# Altium schematic sheet Charging.SchDoc
size A; SheetNumber: 6
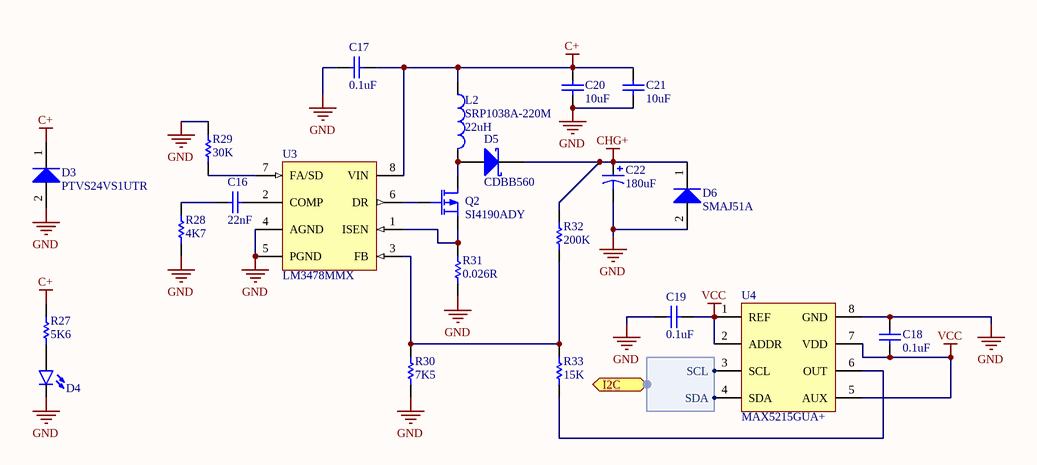
[diagram p0: Charging.SchDoc]

## Parts
C16  value 22nF  [C0402[1005X55]]  (hidden comment: 22nF 50V 0402)
C17  value 0.1uF  [C0402[1005X55]]  (hidden comment: 0.1uF 100V 0402)
C18  value 0.1uF  [C0402[1005X55]]  (hidden comment: 0.1uF 6.3V 0402)
C19  value 0.1uF  [C0402[1005X55]]  (hidden comment: 0.1uF 6.3V 0402)
C20  value 10uF  [C1206[3216X160]]  (hidden comment: 10uF 50V 1206)
C21  value 10uF  [C1206[3216X160]]  (hidden comment: 10uF 50V 1206)
C22  value 180uF  [CAP-ELECTROLYTIC[10.0x12.6]]  (hidden comment: 180uF 50V)
D3  PTVS24VS1UTR  [SOD-123W]
D4  LED_0603_GREEN_5mA  [LED0603]  (value not drawn)
D5  CDBB560  [DO-214AA]
D6  SMAJ51A  [DO-214AC]
L2  SRP1038A-220M  value 22uH  [SRP1038A]
Q2  SI4190ADY  [SO-8]
R27  value 5K6  [R0402[1005]]  (hidden comment: 5K6 1% 0402)
R28  value 4K7  [R0402[1005]]  (hidden comment: 4K7 1% 0402)
R29  value 30K  [R0402[1005]]  (hidden comment: 30K 1% 0402)
R30  value 7K5  [R0402[1005]]  (hidden comment: 7K5 1% 0402)
R31  value 0.026R  [R1206[3216]]  (hidden comment: 0.026R 1% 1206)
R32  value 200K  [R0402[1005]]  (hidden comment: 200K 1% 0402)
R33  value 15K  [R0402[1005]]  (hidden comment: 15K 1% 0402)
U3  LM3478MMX  [MSOP-8]
U4  MAX5215GUA+  [MSOP-8]

## Ports
I2C (harness I2C)

## Harnesses
I2C: SCL, SDA

## Nets
C+: C17.2 C20.2 C21.2 D3.1(K) L2.1 R27.2 U3.8(VIN)
CHG+: C22.1 D5.2(K) D6.1(K) R32.2
GND: C17.1 C18.1 C19.1 C20.1 C21.1 C22.2 D3.2(A) D4.C D6.2(A) R28.1 R29.2 R30.1 R31.1 U3.4(AGND) U3.5(PGND) U4.8(GND)
VCC: C18.2 C19.2 U4.1(REF) U4.2(ADDR) U4.5(AUX) U4.7(VDD)
NetC16_1: C16.1 R28.2
NetC16_2: C16.2 U3.2(COMP)
NetD4_A: D4.A R27.1
NetD5_1: D5.1(A) L2.2 Q2.3(D)
NetQ2_1: Q2.1(S) R31.2 U3.1(ISEN)
NetQ2_2: Q2.2(G) U3.6(DR)
NetR29_1: R29.1 U3.7(FA/SD)
NetR30_2: R30.2 R32.1 R33.2 U3.3(FB)
NetR33_1: R33.1 U4.6(OUT)
NetU4_3: U4.3(SCL) ; port I2C.SCL
NetU4_4: U4.4(SDA) ; port I2C.SDA

## Library data of the parts
C16 = CAP_22nF_50V_0402_10%: 22nF 50V 10% 0402 (1005 Metric); PartNumber: GRM155R71H223KA12J; Manufacturer: Murata; Tolerance: 10%; Mounting Technology: Surface Mount; PackageReference: 0402; PackageDescription: 0402 (1005 Metric); Voltage: 50V
C17 = CAP_0.1uF_100V_0402_10%: 0.1uF 100V 10% 0402 (1005 Metric); PartNumber: GRM155R62A104KE14D; Manufacturer: Murata; Mounting Technology: Surface Mount; PackageReference: 0402; PackageDescription: 0402 (1005 Metric); Voltage: 100V; Tolerance: 10%
C18 C19 = CAP_0.1uF_6.3V_0402_10%: 0.1uF 6.3V 10% 0402 (1005 Metric); PartNumber: GRM155R70J104KA01D; Manufacturer: Murata; Mounting Technology: Surface Mount; PackageReference: 0402; PackageDescription: 0402 (1005 Metric); Voltage: 6.3V; Tolerance: 10%
C20 C21 = CAP_10uF_50V_1206_20%: 10uF 50V 20% 1206 (3216 Metric); PartNumber: UMK316BBJ106ML-T; Manufacturer: Taiyo Yuden; Tolerance: 20%; Mounting Technology: Surface Mount; PackageReference: 1206; PackageDescription: 1206 (3216 Metric); Voltage: 50V
C22 = CAP_180uF_50V_20%: 180uF 50V 20%; PartNumber: PCR1H181MCL1GS; Manufacturer: Nichicon; PackageReference: 1H; PackageDescription: 10x12.7mm; Mounting Technology: Surface Mount; Voltage: 50V; Tolerance: 20%
D3 = PTVS24VS1UTR,115: Manufacturer: NXP; Mounting Technology: Surface Mount; PartNumber: PTVS24VS1UTR,115; PackageReference: SOD-123W; PackageDescription: SOD123W, 2-Leads
D4 = LED_0603_GREEN_5mA: PartNumber: LTST-C193TGKT-5A; Manufacturer: Lite-On Inc.; PackageReference: 0603; PackageDescription: 0603 (1608 Metric); Mounting Technology: Surface Mount
D5 = CDBB560-HF: Manufacturer: Comchip Technology; PackageReference: DO-214AA; PackageDescription: DO-214-AA/SMB; 2 C-Bend Leads; Body 5.3 x 3.6 mm, inc. leads (LxW); PartNumber: CDBB560-HF; Mounting Technology: Surface Mount
D6 = SMAJ51A-E3/61: Manufacturer: Vishay; PartNumber: SMAJ51A-E3/61; PackageReference: DO-214AC; PackageDescription: DO-214AC, 2 Leads; Mounting Technology: Surface Mount
L2 = SRP1038A-220M: 22uH 20% 7A 1038; Manufacturer: Bourns; PackageReference: SRP1038A; PartNumber: SRP1038A-220M; Mounting Technology: Surface Mount
Q2 = SI4190ADY-T1-GE3: N-Channel MOSFET; Manufacturer: Vishay; PackageReference: SO-8; PartNumber: SI4190ADY-T1-GE3; Mounting Technology: Surface Mount
R27 = RES_5K6_0402_1%: 5K6 0.063W 1% 0402 (1005 Metric); Manufacturer: KOA Speer; PartNumber: RK73H1ETTP5601F; Power: 0.063W; Tolerance: 1%; Mounting Technology: Surface Mount; PackageReference: 0402; PackageDescription: 0402 (1005 Metric); ComponentLink1Description: Datasheet; ComponentLink1URL: http://www.koaspeer.com/catimages/Products/RK73H/RK73H.pdf
R28 = RES_4K7_0402_1%: 4K7 0.063W 1% 0402 (1005 Metric); Manufacturer: KOA Speer; PartNumber: RK73H1ETTP4701F; Tolerance: 1%; Power: 0.063W; Mounting Technology: Surface Mount; PackageReference: 0402; PackageDescription: 0402 (1005 Metric); ComponentLink1Description: Datasheet; ComponentLink1URL: http://www.koaspeer.com/catimages/Products/RK73H/RK73H.pdf
R29 = RES_30K_0402_1%: 30K 0.063W 1% 0402 (1005 Metric); Manufacturer: KOA Speer; PartNumber: RK73H1ETTP3002F; Tolerance: 1%; Power: 0.063W; Mounting Technology: Surface Mount; PackageReference: 0402; PackageDescription: 0402 (1005 Metric); ComponentLink1Description: Datasheet; ComponentLink1URL: http://www.koaspeer.com/catimages/Products/RK73H/RK73H.pdf
R30 = RES_7K5_0402_1%: 7K5 0.063W 1% 0402 (1005 Metric); Manufacturer: KOA Speer; PartNumber: RK73H1ETTP7501F; Power: 0.063W; Tolerance: 1%; Mounting Technology: Surface Mount; PackageReference: 0402; PackageDescription: 0402 (1005 Metric); ComponentLink1Description: Datasheet; ComponentLink1URL: http://www.koaspeer.com/catimages/Products/RK73H/RK73H.pdf
R31 = RES_0.026R_1206_1%: 0.026R 1W 1% 1206 (3216 Metric); Manufacturer: Panasonic; PartNumber: ERJ-8BWFR027V; Power: 1W; Tolerance: 1%; Mounting Technology: Surface Mount; PackageReference: 1206; PackageDescription: 1206 (3216 Metric); ComponentLink1Description: Datasheet; ComponentLink1URL: https://industrial.panasonic.com/cdbs/www-data/pdf/RDA0000/AOA0000C239.pdf
R32 = RES_200K_0402_1%: 200K 0.063W 1% 0402 (1005 Metric); Manufacturer: KOA Speer; PartNumber: RK73H1ETTP2003F; Power: 0.063W; Tolerance: 1%; Mounting Technology: Surface Mount; PackageReference: 0402; PackageDescription: 0402 (1005 Metric); ComponentLink1Description: Datasheet; ComponentLink1URL: http://www.koaspeer.com/catimages/Products/RK73H/RK73H.pdf
R33 = RES_15K_0402_1%: 15K 0.063W 1% 0402 (1005 Metric); Manufacturer: KOA Speer; PartNumber: RK73H1ETTP1502F; Tolerance: 1%; Power: 0.063W; Mounting Technology: Surface Mount; PackageReference: 0402; PackageDescription: 0402 (1005 Metric); ComponentLink1Description: Datasheet; ComponentLink1URL: http://www.koaspeer.com/catimages/Products/RK73H/RK73H.pdf
U3 = LM3478MMX: High Efficiency Low-Side N-Channel Controller for Switching Regulator, 8-pin MSOP, Pb-Free, 1000 Reel; Manufacturer: Texas Instruments; PartNumber: LM3478MMX/NOPB; PackageReference: MSOP-8; Mounting Technology: Surface Mount
U4 = MAX5215GUA+: 14 Bit Digital to Analog Converter; Manufacturer: Maxim Integrated; PartNumber: MAX5215GUA+; Mounting Technology: Surface Mount; PackageReference: MSOP-8